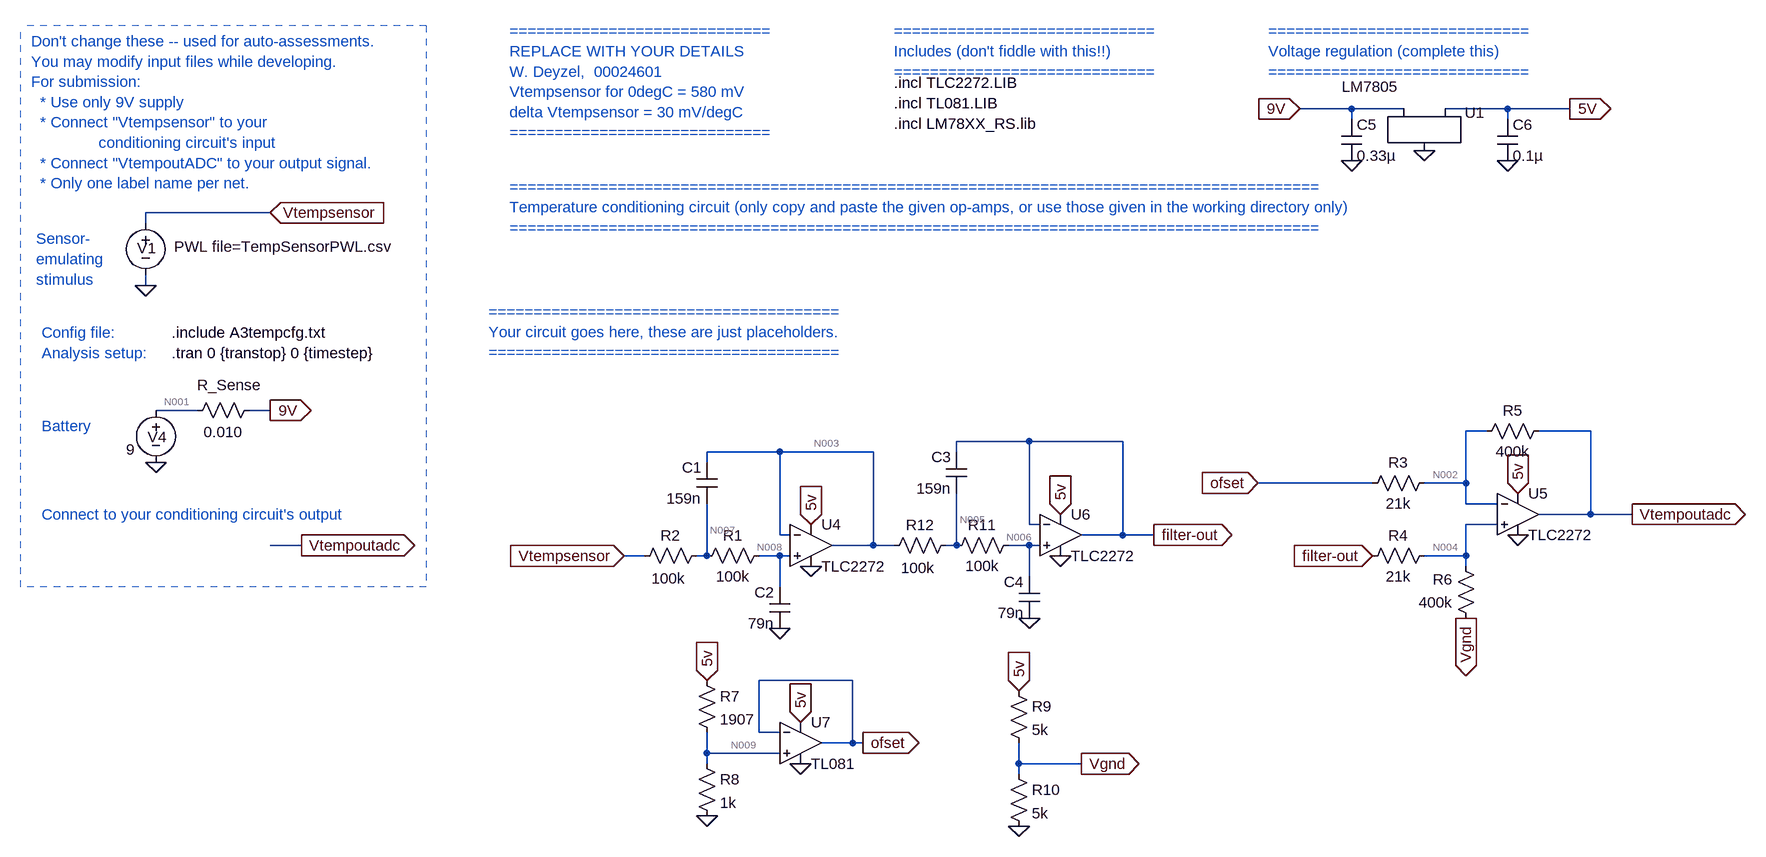
[diagram p0: schematic E344_A3_temp.asc]
E344_A3_temp.asc, the LTspice schematic file:
Version 4
SHEET 1 1824 680
WIRE -256 -1280 -336 -1280
WIRE -176 -1280 -256 -1280
WIRE -16 -1280 -112 -1280
WIRE 80 -1280 -16 -1280
WIRE -256 -1264 -256 -1280
WIRE -16 -1264 -16 -1280
WIRE -1920 -1120 -2112 -1120
WIRE -2112 -1104 -2112 -1120
WIRE -2112 -1008 -2112 -1024
WIRE -2032 -816 -2096 -816
WIRE -1920 -816 -1952 -816
WIRE -48 -784 -80 -784
WIRE 112 -784 32 -784
WIRE -752 -768 -864 -768
WIRE -608 -768 -752 -768
WIRE -1136 -752 -1248 -752
WIRE -992 -752 -1136 -752
WIRE -864 -752 -864 -768
WIRE -1248 -736 -1248 -752
WIRE -224 -704 -400 -704
WIRE -80 -704 -80 -784
WIRE -80 -704 -144 -704
WIRE -80 -672 -80 -704
WIRE -32 -672 -80 -672
WIRE 112 -656 112 -784
WIRE 112 -656 32 -656
WIRE 176 -656 112 -656
WIRE -752 -640 -752 -768
WIRE -736 -640 -752 -640
WIRE -32 -640 -80 -640
WIRE -1136 -624 -1136 -752
WIRE -1120 -624 -1136 -624
WIRE -608 -624 -608 -768
WIRE -608 -624 -672 -624
WIRE -560 -624 -608 -624
WIRE -1872 -608 -1920 -608
WIRE -992 -608 -992 -752
WIRE -992 -608 -1056 -608
WIRE -960 -608 -992 -608
WIRE -864 -608 -864 -688
WIRE -864 -608 -880 -608
WIRE -752 -608 -784 -608
WIRE -736 -608 -752 -608
WIRE -1344 -592 -1376 -592
WIRE -1248 -592 -1248 -672
WIRE -1248 -592 -1264 -592
WIRE -1136 -592 -1168 -592
WIRE -1120 -592 -1136 -592
WIRE -80 -592 -80 -640
WIRE -80 -592 -144 -592
WIRE -80 -576 -80 -592
WIRE -752 -560 -752 -608
WIRE -1136 -544 -1136 -592
WIRE -1024 -400 -1168 -400
WIRE -1168 -320 -1168 -400
WIRE -1136 -320 -1168 -320
WIRE -1024 -304 -1024 -400
WIRE -1024 -304 -1072 -304
WIRE -1008 -304 -1024 -304
WIRE -1248 -288 -1248 -320
WIRE -1136 -288 -1248 -288
WIRE -1248 -272 -1248 -288
WIRE -768 -272 -768 -304
WIRE -672 -272 -768 -272
WIRE -768 -256 -768 -272
FLAG -2112 -1008 0
FLAG -1920 -1120 Vtempsensor
IOPIN -1920 -1120 In
FLAG -1920 -816 9V
IOPIN -1920 -816 Out
FLAG -2096 -736 0
FLAG -336 -1280 9V
IOPIN -336 -1280 In
FLAG -1376 -592 Vtempsensor
IOPIN -1376 -592 In
FLAG -144 -1216 0
FLAG 80 -1280 5V
IOPIN 80 -1280 Out
FLAG 176 -656 Vtempoutadc
IOPIN 176 -656 Out
FLAG -1872 -608 Vtempoutadc
IOPIN -1872 -608 Out
FLAG -1088 -576 0
FLAG -1088 -640 5v
IOPIN -1088 -640 In
FLAG -560 -624 filter-out
IOPIN -560 -624 Out
FLAG -1136 -480 0
FLAG -1248 -400 5v
IOPIN -1248 -400 In
FLAG -1248 -192 0
FLAG -1008 -304 ofset
IOPIN -1008 -304 Out
FLAG -224 -592 filter-out
IOPIN -224 -592 In
FLAG 0 -624 0
FLAG 0 -688 5v
IOPIN 0 -688 In
FLAG -768 -384 5v
IOPIN -768 -384 In
FLAG -768 -176 0
FLAG -672 -272 Vgnd
IOPIN -672 -272 Out
FLAG -80 -496 Vgnd
IOPIN -80 -496 Out
FLAG -704 -592 0
FLAG -704 -656 5v
IOPIN -704 -656 In
FLAG -752 -496 0
FLAG -400 -704 ofset
IOPIN -400 -704 In
FLAG -1104 -272 0
FLAG -1104 -336 5v
IOPIN -1104 -336 In
FLAG -256 -1200 0
FLAG -16 -1200 0
SYMBOL voltage -2112 -1120 R0
WINDOW 123 0 0 Left 0
WINDOW 39 0 0 Left 0
WINDOW 3 44 52 Left 2
WINDOW 0 -13 54 Left 2
SYMATTR Value PWL file=TempSensorPWL.csv
SYMATTR InstName V1
SYMBOL voltage -2096 -832 R0
WINDOW 123 24 44 Left 2
WINDOW 39 0 0 Left 0
WINDOW 3 -46 76 Left 2
WINDOW 0 -13 57 Left 2
SYMATTR Value 9
SYMATTR InstName V4
SYMBOL res -1936 -832 R90
WINDOW 0 -7 47 VBottom 2
WINDOW 3 34 56 VTop 2
SYMATTR InstName R_Sense
SYMATTR Value 0.010
SYMBOL LM7805 -144 -1264 R0
WINDOW 3 -83 -66 Top 2
SYMATTR InstName U1
SYMBOL res -1152 -608 R90
WINDOW 0 0 56 VBottom 2
WINDOW 3 32 56 VTop 2
SYMATTR InstName R1
SYMATTR Value 100k
SYMBOL res -1248 -608 R90
WINDOW 0 0 56 VBottom 2
WINDOW 3 35 59 VTop 2
SYMATTR InstName R2
SYMATTR Value 100k
SYMBOL cap -1232 -672 R180
WINDOW 0 24 56 Left 2
WINDOW 3 24 8 Left 2
SYMATTR InstName C1
SYMATTR Value 159n
SYMBOL cap -1120 -480 R180
WINDOW 0 24 56 Left 2
WINDOW 3 24 8 Left 2
SYMATTR InstName C2
SYMATTR Value 79n
SYMBOL Opamps\\opamp2 -1088 -672 R0
SYMATTR InstName U4
SYMATTR Value TLC2272
SYMBOL res -128 -720 R90
WINDOW 0 0 56 VBottom 2
WINDOW 3 32 56 VTop 2
SYMATTR InstName R3
SYMATTR Value 21k
SYMBOL res -128 -608 R90
WINDOW 0 0 56 VBottom 2
WINDOW 3 32 56 VTop 2
SYMATTR InstName R4
SYMATTR Value 21k
SYMBOL res 48 -800 R90
WINDOW 0 0 56 VBottom 2
WINDOW 3 32 56 VTop 2
SYMATTR InstName R5
SYMATTR Value 400k
SYMBOL res -64 -480 R180
WINDOW 0 36 76 Left 2
WINDOW 3 36 40 Left 2
SYMATTR InstName R6
SYMATTR Value 400k
SYMBOL res -1264 -416 R0
SYMATTR InstName R7
SYMATTR Value 1907
SYMBOL res -1264 -288 R0
SYMATTR InstName R8
SYMATTR Value 1k
SYMBOL Opamps\\opamp2 0 -720 R0
SYMATTR InstName U5
SYMATTR Value TLC2272
SYMBOL res -784 -400 R0
SYMATTR InstName R9
SYMATTR Value 5k
SYMBOL res -784 -272 R0
SYMATTR InstName R10
SYMATTR Value 5k
SYMBOL res -768 -624 R90
WINDOW 0 0 56 VBottom 2
WINDOW 3 32 56 VTop 2
SYMATTR InstName R11
SYMATTR Value 100k
SYMBOL res -864 -624 R90
WINDOW 0 0 56 VBottom 2
WINDOW 3 35 59 VTop 2
SYMATTR InstName R12
SYMATTR Value 100k
SYMBOL cap -848 -688 R180
WINDOW 0 24 56 Left 2
WINDOW 3 24 8 Left 2
SYMATTR InstName C3
SYMATTR Value 159n
SYMBOL cap -736 -496 R180
WINDOW 0 24 56 Left 2
WINDOW 3 24 8 Left 2
SYMATTR InstName C4
SYMATTR Value 79n
SYMBOL Opamps\\opamp2 -704 -688 R0
SYMATTR InstName U6
SYMATTR Value TLC2272
SYMBOL Opamps\\opamp2 -1104 -368 R0
SYMATTR InstName U7
SYMATTR Value TL081
SYMBOL cap -272 -1264 R0
SYMATTR InstName C5
SYMATTR Value 0.33µ
SYMBOL cap -32 -1264 R0
SYMATTR InstName C6
SYMATTR Value 0.1µ
TEXT -2072 -904 Left 2 !.tran 0 {transtop} 0 {timestep}
TEXT -2072 -936 Left 2 !.include A3tempcfg.txt
TEXT -2288 -1384 Left 2 ;Don't change these -- used for auto-assessments.\nYou may modify input files while developing.\nFor submission: \n  * Use only 9V supply \n  * Connect "Vtempsensor" to your \n               conditioning circuit's input\n  * Connect "VtempoutADC" to your output signal.\n  * Only one label name per net.
TEXT -2272 -936 Left 2 ;Config file:
TEXT -2272 -904 Left 2 ;Analysis setup:
TEXT -2272 -792 Left 2 ;Battery
TEXT -2280 -1080 Left 2 ;Sensor-\nemulating \nstimulus
TEXT -1552 -1400 Left 2 ;=============================\nREPLACE WITH YOUR DETAILS\nW. Deyzel,  00024601\nVtempsensor for 0degC = 580 mV\ndelta Vtempsensor = 30 mV/degC\n=============================
TEXT -1552 -1160 Left 2 ;==========================================================================================\nTemperature conditioning circuit (only copy and paste the given op-amps, or use those given in the working directory only)\n==========================================================================================
TEXT -384 -1400 Left 2 ;=============================\nVoltage regulation (complete this)\n=============================
TEXT -960 -1320 Left 2 !.incl TLC2272.LIB\n.incl TL081.LIB\n.incl LM78XX_RS.lib
TEXT -2272 -656 Left 2 ;Connect to your conditioning circuit's output
TEXT -960 -1400 Left 2 ;=============================\nIncludes (don't fiddle with this!!)\n=============================
TEXT -1584 -968 Left 2 ;=======================================\nYour circuit goes here, these are just placeholders.\n=======================================
LINE Normal -2304 -544 -2304 -1408 1
LINE Normal -1680 -1408 -1680 -544 1
LINE Normal -1680 -544 -2304 -544 1
LINE Normal -1680 -1408 -2304 -1408 1

The netlist it stands for:
* E344_A3_temp.asc
V1 Vtempsensor 0 PWL file=TempSensorPWL.csv
V4 N001 0 9
R_Sense 9V N001 0.010
XU1 9V 0 5V LM7805
R1 N008 N007 100k
R2 N007 Vtempsensor 100k
C1 N007 N003 159n
C2 0 N008 79n
XU4 N008 N003 5V 0 N003 TLC2272  ; pins In+ In- V+ V- OUT
R3 N002 ofset 21k
R4 N004 filter-out 21k
R5 Vtempoutadc N002 400k
R6 Vgnd N004 400k
R7 5V N009 1907
R8 N009 0 1k
XU5 N004 N002 5V 0 Vtempoutadc TLC2272  ; pins In+ In- V+ V- OUT
R9 5V Vgnd 5k
R10 Vgnd 0 5k
R11 N006 N005 100k
R12 N005 N003 100k
C3 N005 filter-out 159n
C4 0 N006 79n
XU6 N006 filter-out 5V 0 filter-out TLC2272  ; pins In+ In- V+ V- OUT
XU7 N009 ofset 5V 0 ofset TL081  ; pins In+ In- V+ V- OUT
C5 9V 0 0.33µ
C6 5V 0 0.1µ
.tran 0 {transtop} 0 {timestep}
.include A3tempcfg.txt
* Don't change these -- used for auto-assessments.
* You may modify input files while developing.
* For submission:
*   * Use only 9V supply
*   * Connect "Vtempsensor" to your
*                conditioning circuit's input
*   * Connect "VtempoutADC" to your output signal.
*   * Only one label name per net.
* Config file:
* Analysis setup:
* Battery
* Sensor-
* emulating
* stimulus
* =============================
* REPLACE WITH YOUR DETAILS
* W. Deyzel,  00024601
* Vtempsensor for 0degC = 580 mV
* delta Vtempsensor = 30 mV/degC
* =============================
* ==========================================================================================
* Temperature conditioning circuit (only copy and paste the given op-amps, or use those given in the working directory only)
* ==========================================================================================
* =============================
* Voltage regulation (complete this)
* =============================
.incl TLC2272.LIB
.incl TL081.LIB
.incl LM78XX_RS.lib
* Connect to your conditioning circuit's output
* =============================
* Includes (don't fiddle with this!!)
* =============================
* =======================================
* Your circuit goes here, these are just placeholders.
* =======================================
.backanno
.end

* Results of the author's LTspice run, read from the files saved beside the schematic
* Operating Point, zero values left out:
*   V(vtempsensor) = 1.6 V
*   V(n001) = 9 V
*   V(9v) = 9 V
*   V(5v) = 5.003 V
*   V(n008) = 1.6 V
*   V(n007) = 1.6 V
*   V(n003) = 1.6 V
*   V(n002) = 1.646 V
*   V(ofset) = 1.721 V
*   V(n004) = 1.645 V
*   V(filter-out) = 1.601 V
*   V(vtempoutadc) = 207.2 mV
*   V(vgnd) = 2.496 V
*   V(n009) = 1.721 V
*   V(n006) = 1.6 V
*   V(n005) = 1.6 V
*   I(R10) = 499.2 µA
*   I(R9) = 501.3 µA
*   I(R8) = 1.721 mA
*   I(R7) = 1.721 mA
*   I(R6) = 2.127 µA
*   I(R5) = -3.596 µA
*   I(R4) = 2.127 µA
*   I(R3) = -3.596 µA
*   I(R_sense) = -16.97 mA
*   I(V4) = -16.97 mA